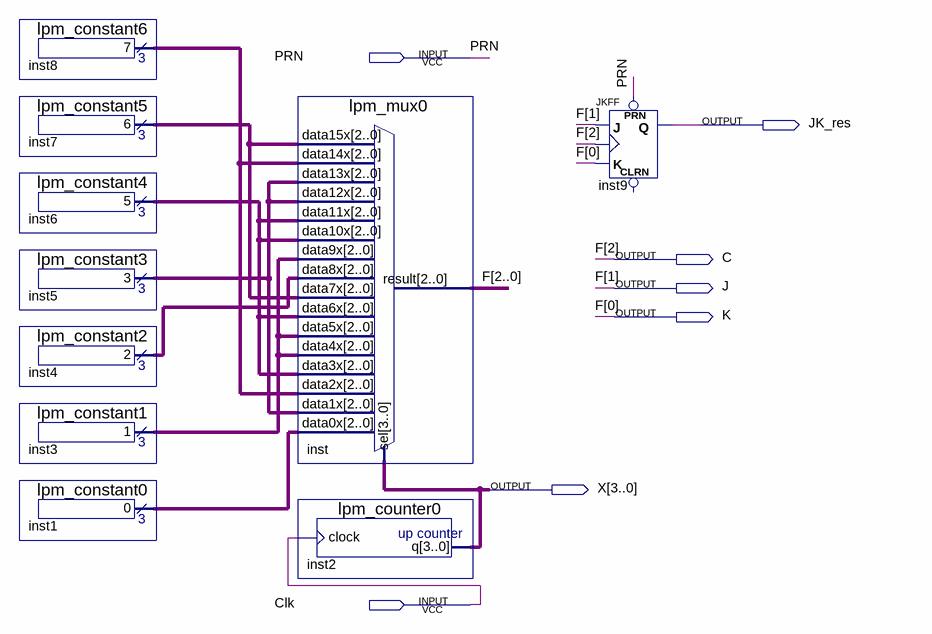
[diagram p0: schematic sheet]
// Quartus schematic lab04_JK.bdf as structural Verilog: 10 symbols, 7 pins
module lab04_JK (
  input  PRN,
  input  Clk,
  output JK_res,
  output C,
  output J,
  output K,
  output [3:0] X
);

  wire [2:0] inst1_result, inst3_result, inst4_result, inst5_result, inst6_result, inst7_result, inst8_result;

  lpm_constant6 inst8 (.result(inst8_result));
  lpm_constant5 inst7 (.result(inst7_result));
  lpm_constant4 inst6 (.result(inst6_result));
  lpm_constant3 inst5 (.result(inst5_result));
  lpm_constant2 inst4 (.result(inst4_result));
  lpm_constant1 inst3 (.result(inst3_result));
  lpm_constant0 inst1 (.result(inst1_result));
  lpm_mux0 inst (
    .data15x(inst7_result), .data14x(inst8_result), .data13x(inst5_result), .data12x(inst5_result),
    .data11x(inst6_result), .data10x(inst6_result), .data9x(inst3_result), .data8x(inst4_result),
    .data7x(inst7_result), .data6x(inst6_result), .data5x(inst3_result), .data4x(inst3_result),
    .data3x(inst6_result), .data2x(inst8_result), .data1x(inst5_result), .data0x(inst1_result), .sel(X),
    .result({C, J, K}));
  lpm_counter0 inst2 (.clock(Clk), .q(X));
  JKFF inst9 (.PRN(PRN), .K(K), .J(J), .CLK(C), .Q(JK_res));  // open: CLRN

  // Other names for the same wires on the sheet: F[2:0] = {C, J, K}
endmodule
